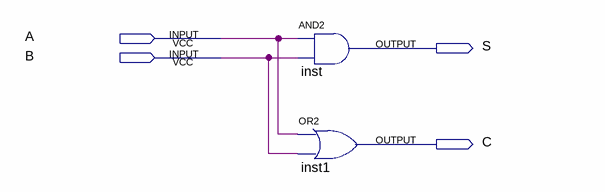
[diagram p0: schematic sheet]
// Quartus schematic semiSumador.bdf as structural Verilog: 2 symbols, 4 pins
module semiSumador (
  input  A,
  input  B,
  output S,
  output C
);

  and inst (S, A, B);
  or inst1 (C, A, B);
endmodule
